# Altium schematic sheet User_Connectors.SchDoc
size A4; CompanyName: Technische Hochschule Nürnberg Georg Simon Ohm; Organization: UltraZohm; Address1: Kesslerplatz 12; Address2: 90489 Nürnberg; Address3: GERMANY; SheetNumber: 31; Website: www.ultrazohm.com
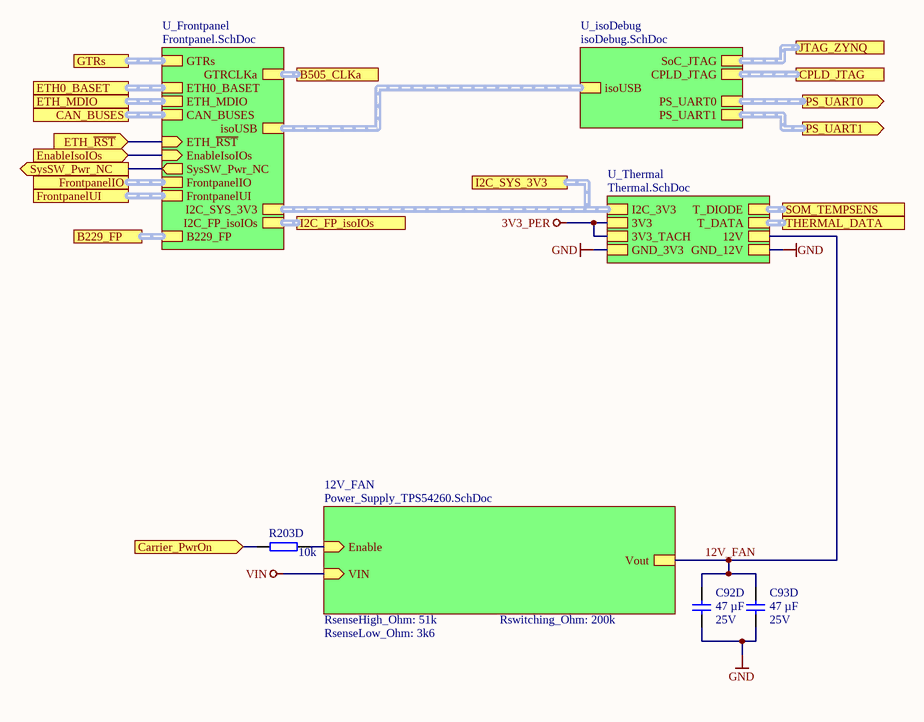
[diagram p0: User_Connectors.SchDoc]

## Parts
C92D  47 µF  Voltage: 25V  [C_1206_TE]
C93D  47 µF  Voltage: 25V  [C_1206_TE]
R203D  10k  [R_0603_TE]

## Sub-sheets
12V_FAN = Power_Supply_TPS54260.SchDoc: Vout, Enable (in), VIN (in)  | RsenseHigh_Ohm: 51k; RsenseLow_Ohm: 3k6; Rswitching_Ohm: 200k; SubSheet_SheetNumber: 37; Output_V: 12
U_Frontpanel = Frontpanel.SchDoc: GTRs (harness GTRs), ETH0_BASET (harness ETH_BASET), ETH_MDIO (harness ETH_MDIO), isoUSB (harness USB), I2C_SYS_3V3 (harness I2C), FrontpanelUI (harness FrontpanelUI), SysSW_Pwr_NC (out), GTRCLKa (harness MGTCLK), CAN_BUSES (harness CAN_BUSES), FrontpanelIO (harness FrontpanelIO), ETH_~{RST} (in), EnableIsoIOs (in), I2C_FP_isoIOs (harness I2C), B229_FP (harness GTH)
U_isoDebug = isoDebug.SchDoc: SoC_JTAG (harness JTAG), CPLD_JTAG (harness JTAG), PS_UART0 (harness UART), PS_UART1 (harness UART), isoUSB (harness USB)  | SubSheet_SheetNumber: 33
U_Thermal = Thermal.SchDoc: I2C_3V3 (harness I2C), T_DIODE (harness T_DIODE), T_DATA (harness T_DATA), 12V, 3V3, 3V3_TACH, GND_3V3, GND_12V  | SubSheet_SheetNumber: 36

## Ports
B229_FP (harness GTH), B505_CLKa (harness MGTCLK), CAN_BUSES (harness CAN_BUSES), Carrier_PwrOn (in), CPLD_JTAG (harness JTAG), EnableIsoIOs (in), ETH0_BASET (harness ETH_BASET), ETH_MDIO (harness ETH_MDIO), ETH_~{RST} (in), FrontpanelIO (harness FrontpanelIO), FrontpanelUI (harness FrontpanelUI), GTRs (harness GTRs), I2C_FP_isoIOs (harness I2C), I2C_SYS_3V3 (harness I2C), JTAG_ZYNQ (harness JTAG), PS_UART0 (out, harness UART), PS_UART1 (out, harness UART), SOM_TEMPSENS (harness T_DIODE), SysSW_Pwr_NC (out), THERMAL_DATA (harness T_DATA)

## Nets
3V3_PER: sheet U_Thermal/3V3, sheet U_Thermal/3V3_TACH
GND: C92D.1 C93D.1 ; sheet U_Thermal/GND_3V3, sheet U_Thermal/GND_12V
VIN: sheet 12V_FAN/VIN
12V_FAN: C92D.2 C93D.2 ; sheet U_Thermal/12V, sheet 12V_FAN/Vout
Carrier_PwrOn: R203D.1 ; port Carrier_PwrOn
EnableIsoIOs: port EnableIsoIOs, sheet U_Frontpanel/EnableIsoIOs
ETH_~{RST}: port ETH_~{RST}, sheet U_Frontpanel/ETH_~{RST}
SysSW_Pwr_NC: port SysSW_Pwr_NC, sheet U_Frontpanel/SysSW_Pwr_NC
NetR203D_2: R203D.2 ; sheet 12V_FAN/Enable

## Buses and harness runs
harness port B229_FP = sheet U_Frontpanel/B229_FP
harness port B505_CLKa = sheet U_Frontpanel/GTRCLKa
harness port CAN_BUSES = sheet U_Frontpanel/CAN_BUSES
harness port CPLD_JTAG = sheet U_isoDebug/CPLD_JTAG
harness port ETH0_BASET = sheet U_Frontpanel/ETH0_BASET
harness port ETH_MDIO = sheet U_Frontpanel/ETH_MDIO
harness port FrontpanelIO = sheet U_Frontpanel/FrontpanelIO
harness port FrontpanelUI = sheet U_Frontpanel/FrontpanelUI
harness port GTRs = sheet U_Frontpanel/GTRs
harness port I2C_FP_isoIOs = sheet U_Frontpanel/I2C_FP_isoIOs
harness port I2C_SYS_3V3 = sheet U_Frontpanel/I2C_SYS_3V3 = sheet U_Thermal/I2C_3V3
harness port JTAG_ZYNQ = sheet U_isoDebug/SoC_JTAG
harness port PS_UART0 = sheet U_isoDebug/PS_UART0
harness port PS_UART1 = sheet U_isoDebug/PS_UART1
harness port SOM_TEMPSENS = sheet U_Thermal/T_DIODE
harness port THERMAL_DATA = sheet U_Thermal/T_DATA
harness sheet U_Frontpanel/isoUSB = sheet U_isoDebug/isoUSB

## Notes on the sheet
- Title
- Revision:
- Design Engineer:
- Date:
- Project:
- Sheet
- of

## Library data of the parts
C92D C93D = UZgen_C_1206_47uF_25V_X7R: Generic capacitor; Manufacturer: UZgen; Tolerance: 10 %; Created from: UZgenTool; Value: 47 µF; Technology: X7R; Manufacturer Part Number: UZgen_C_1206_47uF_25V_X7R; PartID: 5224; Created On: 02/08/2024 11:18:30; Device Package: 1206; Mounting Type: SMD; Last Updated: 02/08/2024 11:18:30
R203D = UZgen_R_0603_10k: Generic resistor; Manufacturer: UZgen; Tolerance: 1 %; Created from: AGeiger; Value: 10k; Manufacturer Part Number: UZgen_R_0603_10k; PartID: 1; Created On: 02.07.2024 14:34:53; Device Package: 0603; Mounting Type: SMD; Last Updated: 02.07.2024 14:37:16